# EAGLE design LVDS-DIP-01 (EAGLE 7.7.0)
LVDS DIP, C.H.I.P. Computer
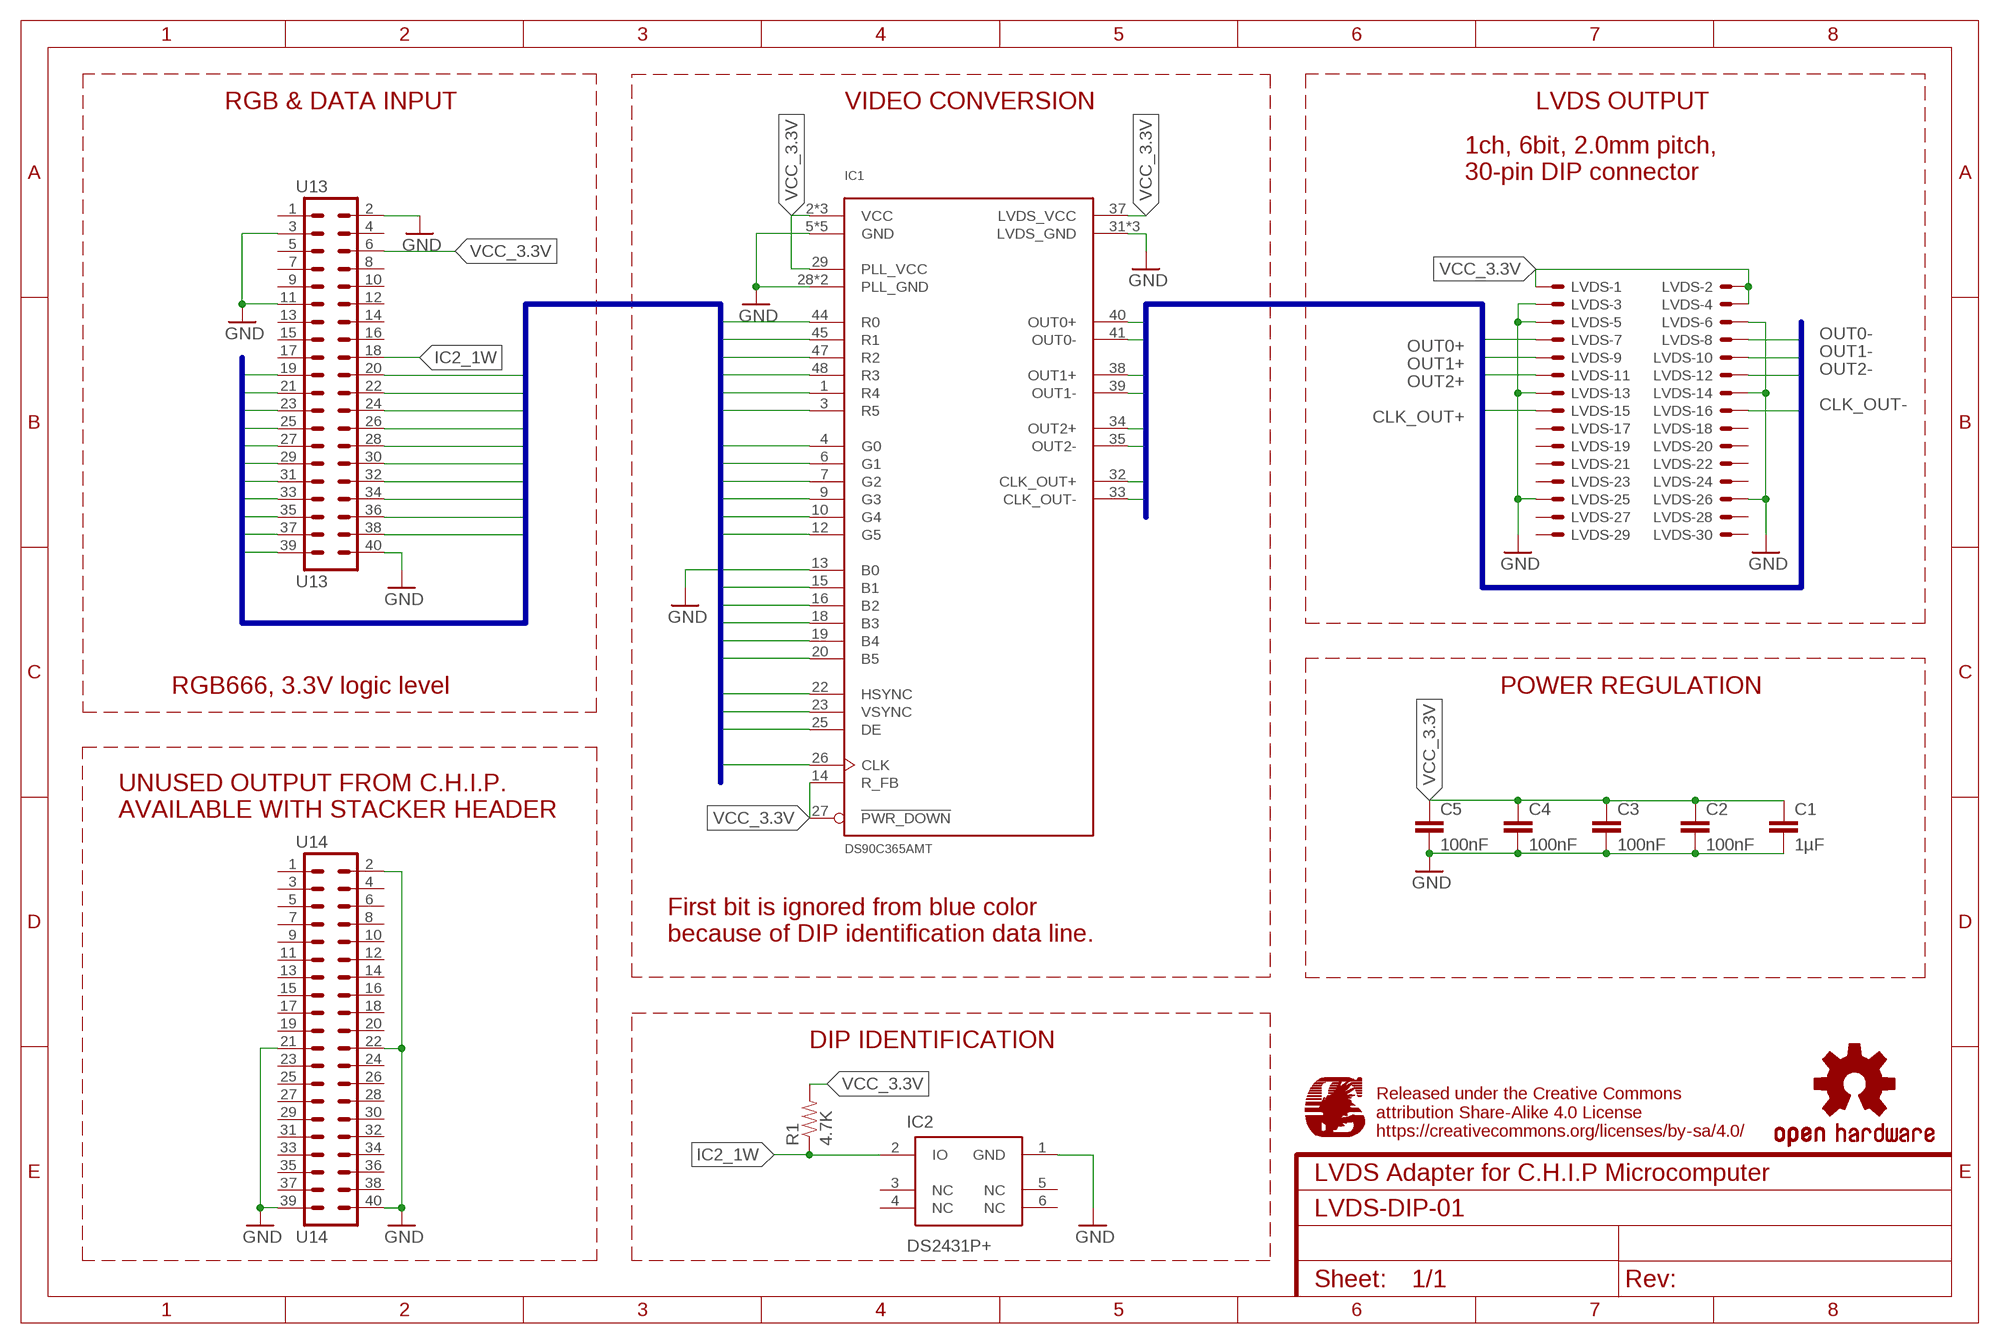
[diagram p0: schematic, sheet 1]
FRAME1 (FRAME-A4L): CNAME: LVDS Adapter for C.H.I.P Microcomputer; CREVISION: 1.00; DESIGNER: Juha P. Varjonen

## Parts
C1  1µF  CAP0603-CAP  [0603-CAP]
C2  100nF  CAP0603-CAP  [0603-CAP]
C3  100nF  CAP0603-CAP  [0603-CAP]
C4  100nF  CAP0603-CAP  [0603-CAP]
C5  100nF  CAP0603-CAP  [0603-CAP]
IC1  DS90C365AMT  [TSSOP48]
IC2  DS2431P+  [DS2431P+T&R]
LOGO1  OSHW-LOGOM  [OSHW-LOGO-M]
LVDS  332-30  [332-30]
R1  4.7K  4.7KOHM-1/10W-1%(0603)  [0603-RES]
U13  U13  M20X2  [2X20]
U14  U14  M20X2  [2X20]

## Nets
B1: IC1.15(B1) U13.19
B2: IC1.16(B2) U13.20
B3: IC1.18(B3) U13.21
B4: IC1.19(B4) U13.22
B5: IC1.20(B5) U13.23
CLK: IC1.26(CLK) U13.36
CLK_OUT+: IC1.32(CLK_OUT+) LVDS.15
CLK_OUT-: IC1.33(CLK_OUT-) LVDS.16
DE: IC1.25(DE) U13.39
G0: IC1.4(G0) U13.24
G1: IC1.6(G1) U13.25
G2: IC1.7(G2) U13.26
G3: IC1.9(G3) U13.27
G4: IC1.10(G4) U13.28
G5: IC1.12(G5) U13.29
GND: C1.2 C2.2 C3.2 C4.2 C5.2 IC1.5(GND) IC1.11(GND) IC1.13(B0) IC1.17(GND) IC1.24(GND) IC1.28(PLL_GND) IC1.30(PLL_GND) IC1.31(LVDS_GND) IC1.36(LVDS_GND) IC1.42(LVDS_GND) IC1.46(GND) IC2.1(GND) LVDS.3 LVDS.5 LVDS.6 LVDS.13 LVDS.14 LVDS.25 LVDS.26 U13.2 U13.3 U13.11 U13.40 U14.2 U14.21 U14.22 U14.39 U14.40
HSYNC: IC1.22(HSYNC) U13.37
IC2_1W: IC2.2(IO) R1.1 U13.18
OUT0+: IC1.40(OUT0+) LVDS.7
OUT0-: IC1.41(OUT0-) LVDS.8
OUT1+: IC1.38(OUT1+) LVDS.9
OUT1-: IC1.39(OUT1-) LVDS.10
OUT2+: IC1.34(OUT2+) LVDS.11
OUT2-: IC1.35(OUT2-) LVDS.12
R0: IC1.44(R0) U13.30
R1: IC1.45(R1) U13.31
R2: IC1.47(R2) U13.32
R3: IC1.48(R3) U13.33
R4: IC1.1(R4) U13.34
R5: IC1.3(R5) U13.35
VCC_3.3V: C1.1 C2.1 C3.1 C4.1 C5.1 IC1.2(VCC) IC1.8(VCC) IC1.14(R_FB) IC1.21(VCC) IC1.27(!PWR_DOWN!) IC1.29(PLL_VCC) IC1.37(LVDS_VCC) LVDS.1 LVDS.2 LVDS.4 R1.2 U13.6
VSYNC: IC1.23(VSYNC) U13.38
Unconnected: IC2.3(NC) IC2.4(NC) IC2.5(NC) IC2.6(NC) LVDS.17 LVDS.18 LVDS.19 LVDS.20 LVDS.21 LVDS.22 LVDS.23 LVDS.24 LVDS.27 LVDS.28 LVDS.29 LVDS.30 U13.1 U13.4 U13.5 U13.7 U13.8 U13.9 U13.10 U13.12 U13.13 U13.14 U13.15 U13.16 U13.17 U14.1 U14.3 U14.4 U14.5 U14.6 U14.7 U14.8 U14.9 U14.10 U14.11 U14.12 U14.13 U14.14 U14.15 U14.16 U14.17 U14.18 U14.19 U14.20 U14.23 U14.24 U14.25 U14.26 U14.27 U14.28 U14.29 U14.30 U14.31 U14.32 U14.33 U14.34 U14.35 U14.36 U14.37 U14.38

## Buses
R[0..5],G[0..5],B[1..5],HSYNC,VSYNC,DE,CLK
OUT0+,OUT0-,OUT1+,OUT1-,OUT2+,OUT2-,CLK_OUT+,CLK_OUT-

## Notes on the sheet
- RGB & DATA INPUT | VIDEO CONVERSION | LVDS OUTPUT
- 1ch, 6bit, 2.0mm pitch, 
  30-pin DIP connector
- RGB666, 3.3V logic level | POWER REGULATION
- UNUSED OUTPUT FROM C.H.I.P.
  AVAILABLE WITH STACKER HEADER
- First bit is ignored from blue color 
  because of DIP identification data line.
- DIP IDENTIFICATION
- Released under the Creative Commons
  attribution Share-Alike 4.0 License
  https://creativecommons.org/licenses/by-sa/4.0/

## Library data of the parts
C1-C5 = SparkFun-Capacitors:CAP: Capacitor Standard 0603 ceramic capacitor, and 0.1" leaded capacitor.
IC1 = DS90C365AMT:DS90C365AMT: 3.3V Programmable LVDS Transmitter, 18-bit, 1ch, RGB666
IC2 = ds2431:DS2431P+: 1024-bit, 1-Wire EEPROM
LOGO1 = SparkFun-Aesthetics:OSHW-LOGO: Open Source Hardware Logo This logo indicates the piece of hardware it is found on incorporates a OSHW license and/or adheres to the definition of open source hardware found here: http://freedomdefined.org/OSHW
LVDS = con-garry:332-30: 30 Pin - 2mm Dual Row Source: www.mpe-connector.de / garry_shortform_2012.pdf
R1 = SparkFun-Resistors:4.7KOHM-1/10W-1%(0603): RES-07857; PROD_ID: RES-07857
U13 U14 = SparkFun-Connectors:M20X2: 0.1" spaced headers

## Board
LVDS Display Adapter for C.H.I.P. Microcomputer
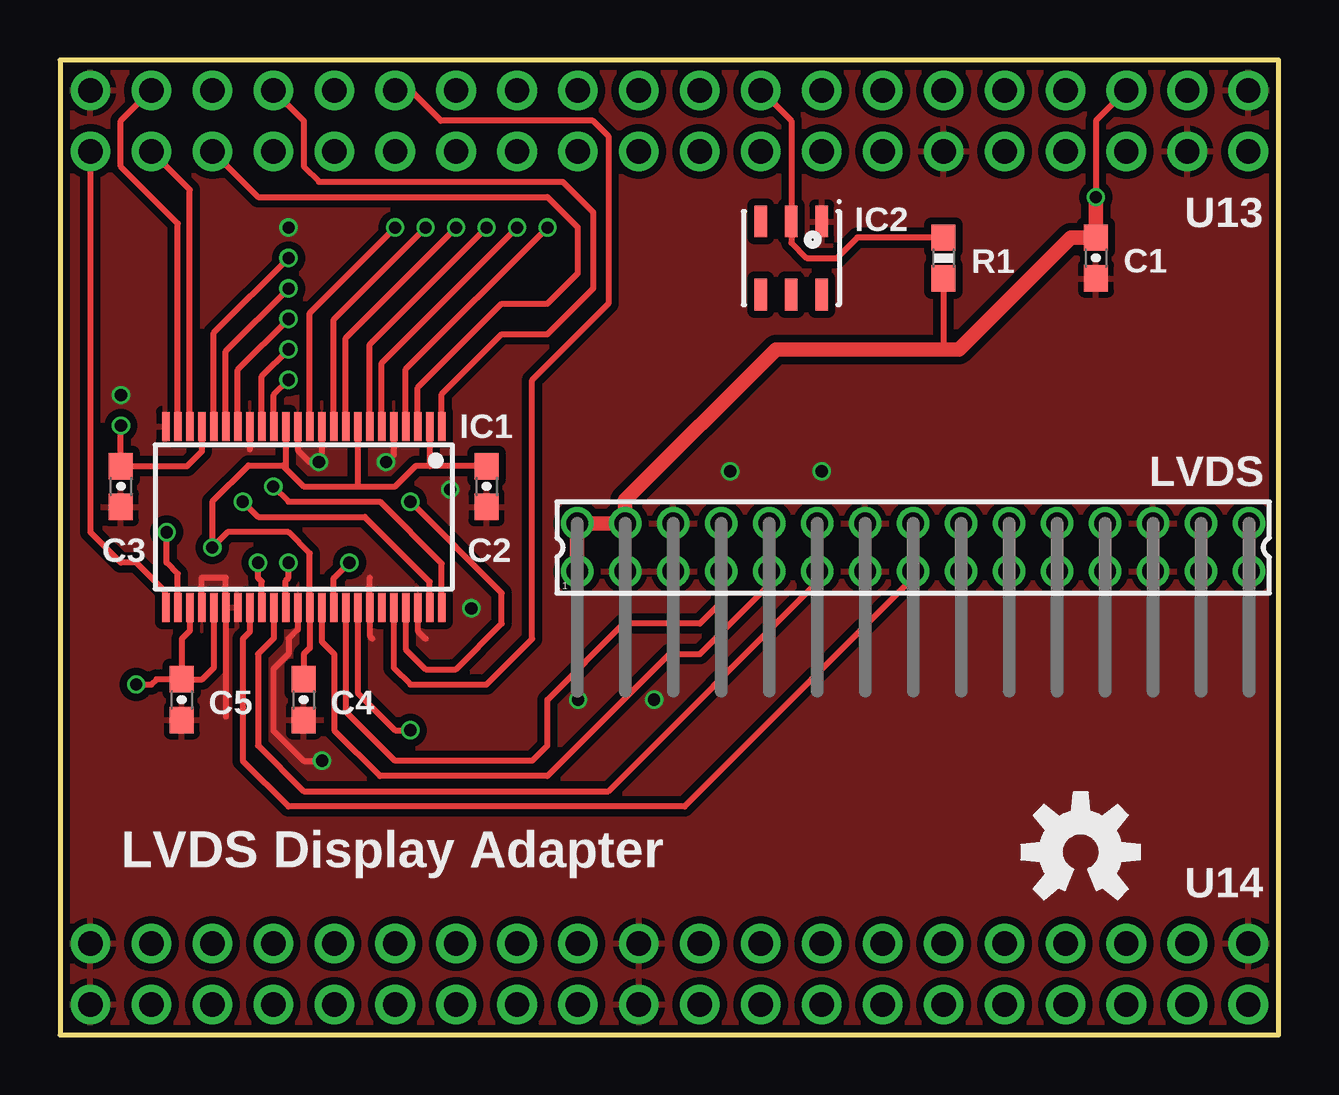
[diagram p1: board, top side]
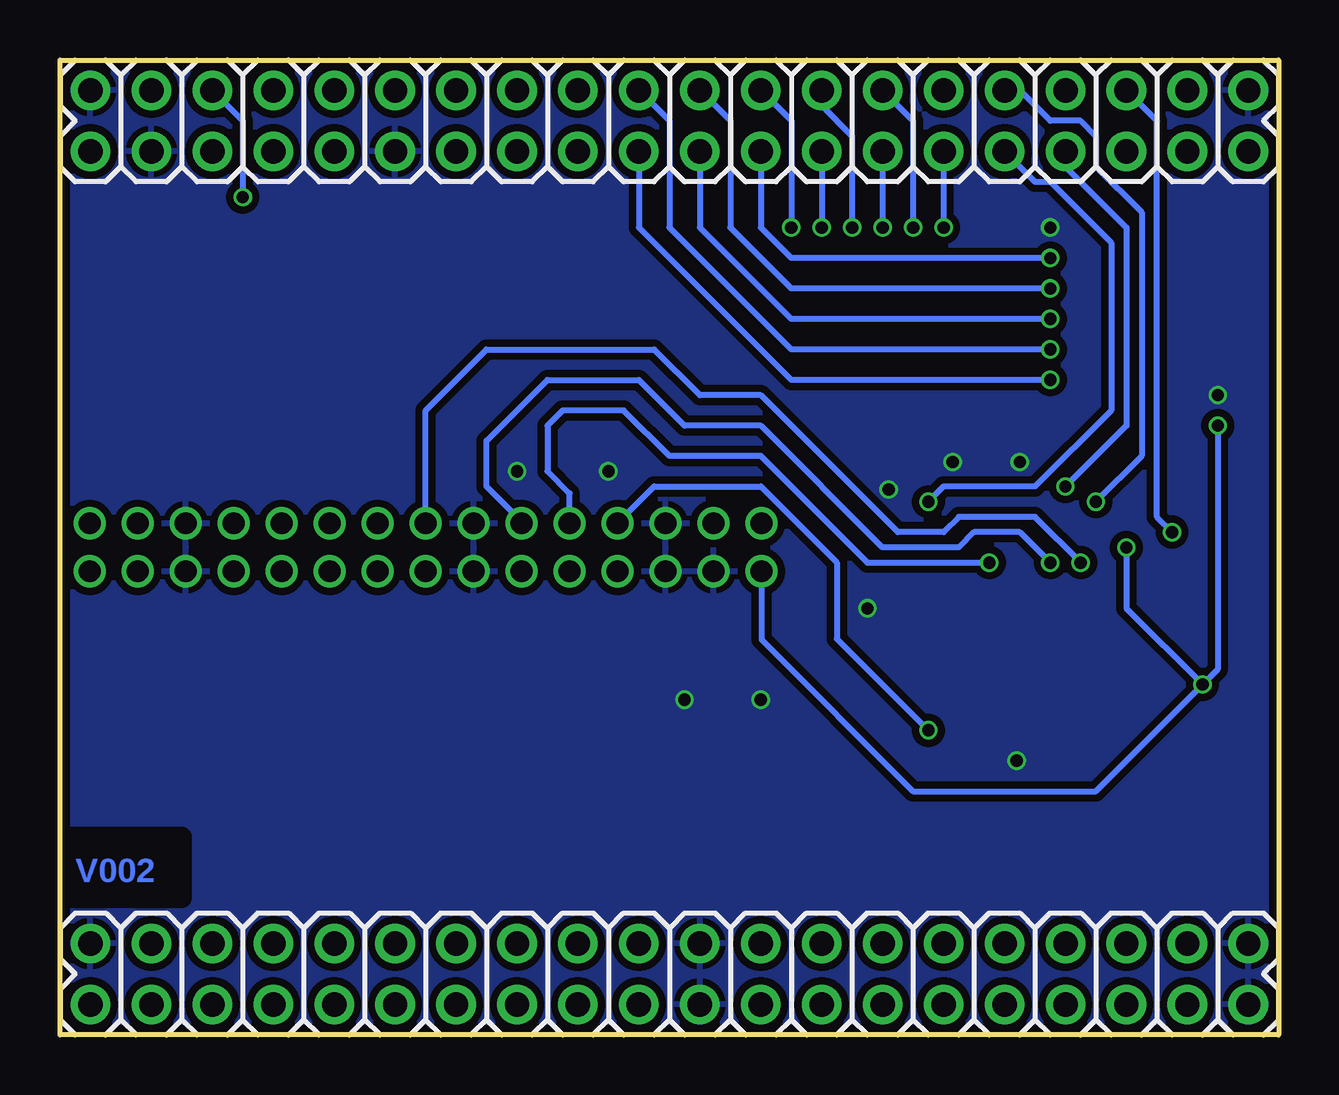
[diagram p2: board, bottom side, seen from below]

Size 50.8 x 40.64 mm. Coordinates in mm from the lower left corner, seen from the top.
Outline: 0,40.64 0,0 50.8,0 50.8,40.64 0,40.64
Copper layers (1*16): Top 0.035mm / dielectric 1.5mm / Bottom 0.035mm
Design rules "SparkFun-2-layer-STANDARD": minimum track width 4mil, minimum drill 6mil, track to track 4mil, track to pad 4mil, pad to pad 4mil, via to via 4mil, smd to smd 4mil, copper to edge 4mil, drill to drill 4mil, minimum pad ring 5mil, minimum via ring 5mil, stop-mask expansion 4mil, vias tented up to drill 25mil, thermal gap 10mil
bRestrict: 4 lines

### Footprints (pad centres in the part's own frame; a part is rotated, then mirrored left to right if it is on the bottom)
0603-CAP = smd 1.1 x 1: 1 -0.85,0; 2 0.85,0
TSSOP48 = smd 0.32 x 1.2: 1 -5.75,-3.775; 2 -5.25,-3.775; 3 -4.75,-3.775; 4 -4.25,-3.775; 5 -3.75,-3.775; 6 -3.25,-3.775; 7 -2.75,-3.775; 8 -2.25,-3.775; 9 -1.75,-3.775; 10 -1.25,-3.775; 11 -0.75,-3.775; 12 -0.25,-3.775; 13 0.25,-3.775; 14 0.75,-3.775; 15 1.25,-3.775; 16 1.75,-3.775; 17 2.25,-3.775; 18 2.75,-3.775; 19 3.25,-3.775; 20 3.75,-3.775; 21 4.25,-3.775; 22 4.75,-3.775; 23 5.25,-3.775; 24 5.75,-3.775; 25 5.75,3.775; 26 5.25,3.775; 27 4.75,3.775; 28 4.25,3.775; 29 3.75,3.775; 30 3.25,3.775; 31 2.75,3.775; 32 2.25,3.775; 33 1.75,3.775; 34 1.25,3.775; 35 0.75,3.775; 36 0.25,3.775; 37 -0.25,3.775; 38 -0.75,3.775; 39 -1.25,3.775; 40 -1.75,3.775; 41 -2.25,3.775; 42 -2.75,3.775; 43 -3.25,3.775; 44 -3.75,3.775; 45 -4.25,3.775; 46 -4.75,3.775; 47 -5.25,3.775; 48 -5.75,3.775
DS2431P+T&R = smd 1.33 x 0.53: 1 -1.525,1.27; 2 -1.525,0; 3 -1.525,-1.27; 4 1.525,-1.27; 5 1.525,0; 6 1.525,1.27
332-30 = drill 0.9 pad 1.27: 1 -14,-1; 2 -14,1; 3 -12,-1; 4 -12,1; 5 -10,-1; 6 -10,1; 7 -8,-1; 8 -8,1; 9 -6,-1; 10 -6,1; 11 -4,-1; 12 -4,1; 13 -2,-1; 14 -2,1; 15 0,-1; 16 0,1; 17 2,-1; 18 2,1; 19 4,-1; 20 4,1; 21 6,-1; 22 6,1; 23 8,-1; 24 8,1; 25 10,-1; 26 10,1; 27 12,-1; 28 12,1; 29 14,-1; 30 14,1
0603-RES = smd 1.1 x 1: 1 -0.85,0; 2 0.85,0
2X20 = drill 1.016 pad 1.651: 1 -24.13,-1.27; 2 -24.13,1.27; 3 -21.59,-1.27; 4 -21.59,1.27; 5 -19.05,-1.27; 6 -19.05,1.27; 7 -16.51,-1.27; 8 -16.51,1.27; 9 -13.97,-1.27; 10 -13.97,1.27; 11 -11.43,-1.27; 12 -11.43,1.27; 13 -8.89,-1.27; 14 -8.89,1.27; 15 -6.35,-1.27; 16 -6.35,1.27; 17 -3.81,-1.27; 18 -3.81,1.27; 19 -1.27,-1.27; 20 -1.27,1.27; 21 1.27,-1.27; 22 1.27,1.27; 23 3.81,-1.27; 24 3.81,1.27; 25 6.35,-1.27; 26 6.35,1.27; 27 8.89,-1.27; 28 8.89,1.27; 29 11.43,-1.27; 30 11.43,1.27; 31 13.97,-1.27; 32 13.97,1.27; 33 16.51,-1.27; 34 16.51,1.27; 35 19.05,-1.27; 36 19.05,1.27; 37 21.59,-1.27; 38 21.59,1.27; 39 24.13,-1.27; 40 24.13,1.27

### Placement (x,y rotation side)
C1  43.18,32.38 270 top
C2  17.78,22.86 270 top
C3  2.54,22.86 270 top
C4  10.16,13.97 270 top
C5  5.08,13.97 270 top
IC1  10.16,21.59 180 top
IC2  30.48,32.38 270 top
LOGO1  42.55,7.62 0 top
LVDS  35.56,20.32 0 top
R1  36.83,32.38 270 top
U13  25.4,38.1 0 bottom
U14  25.4,2.54 0 bottom

### Tracks (layer width: path | path; a pad name or v marks a point on that pad's centre or on a via)
B1  (via drill 0.51)
  Top 0.254: IC1.15 8.91,26.69 v9.53,27.3
  Bottom 0.254: U13.19 26.67,33.66 20.32,27.3 v9.53,27.3
B2  (via drill 0.51)
  Top 0.254: IC1.16 8.41,27.46 v9.53,28.57
  Bottom 0.254: U13.20 25.4,38.1 25.4,33.66 20.32,28.57 v9.53,28.57
B3  (via drill 0.51)
  Top 0.254: IC1.18 7.41,27.73 v9.53,29.84
  Bottom 0.254: U13.21 24.13,33.66 20.32,29.84 v9.53,29.84
B4  (via drill 0.51)
  Top 0.254: IC1.19 6.91,28.5 v9.53,31.11
  Bottom 0.254: U13.22 22.86,38.1 22.86,33.66 20.32,31.11 v9.53,31.11
B5  (via drill 0.51)
  Top 0.254: IC1.20 6.41,29.27 v9.53,32.38
  Bottom 0.254: U13.23 21.59,33.66 20.32,32.38 v9.53,32.38
CLK  (via drill 0.51)
  Top 0.254: IC1.26 4.91,19.22 4.45,19.68 v4.45,20.95
  Bottom 0.254: v4.45,20.95 5.08,21.59 5.08,38.1 U13.36
CLK_OUT+
  Top 0.254: LVDS.15 35.56,19.05 26.04,9.53 9.53,9.53 7.62,11.43 7.62,16.51 7.91,16.8 IC1.32
CLK_OUT-  (via drill 0.51)
  Top 0.254: IC1.33 8.41,18.89 8.26,19.05 v8.26,19.68
  Bottom 0.254: v8.26,19.68 10.16,21.59 13.34,21.59 13.97,20.95 15.88,20.95 21.59,26.67 24.13,26.67 26.04,28.57 33.02,28.57 35.56,26.04 LVDS.16
DE
  Top 0.254: U13.39 1.27,20.95 2.54,19.68 3.17,19.68 4.38,18.48 4.38,17.78 IC1.25
G0  (via drill 0.51)
  Top 0.254: IC1.4 14.41,27.75 v20.32,33.66
  Bottom 0.254: U13.24 20.32,38.1 v20.32,33.66
G1  (via drill 0.51)
  Top 0.254: IC1.6 13.41,28.02 v19.05,33.66
  Bottom 0.254: U13.25 v19.05,33.66
G2  (via drill 0.51)
  Top 0.254: IC1.7 12.91,28.79 v17.78,33.66
  Bottom 0.254: U13.26 19.05,38.73 17.78,37.47 v17.78,33.66
G3  (via drill 0.51)
  Top 0.254: IC1.9 11.91,29.05 v16.51,33.66
  Bottom 0.254: U13.27 v16.51,33.66
G4  (via drill 0.51)
  Top 0.254: v15.24,33.66 11.41,29.82 IC1.10
  Bottom 0.254: U13.28 15.24,38.1 v15.24,33.66
G5  (via drill 0.51)
  Top 0.254: v13.97,33.66 10.41,30.09 IC1.12
  Bottom 0.254: U13.29 v13.97,33.66
GND  (via drill 0.51)
  Top 0.254: IC1.17 7.91,24.42 | IC1.46 14.91,16.84 15.24,16.51 | 6.91,13.26 IC1.30 6.91,19.05 5.91,19.05 IC1.28 | IC1.11 10.91,24.25 | IC1.5 13.91,24.19 | IC1.13 9.91,24.38 10.41,23.88 v10.79,23.88 | 13.03,16.51 12.91,16.63 IC1.42 12.91,19.05 | IC1.36 9.91,16.89 9.53,16.51 9.53,15.88 8.89,15.24 8.89,12.7 10.16,11.43 v10.92,11.43
  other vias: 2.54,26.67 17.14,17.78 16.26,22.73 13.59,23.88 27.94,23.5 31.75,23.5 21.59,13.97 24.77,13.97 9.53,33.66
  pour Bottom (isolate 0.305): 0,40.64 50.8,40.64 50.8,0 0,0
  pour Top (isolate 0.305): 0,40.64 50.8,40.64 50.8,0 0,0
HSYNC
  Top 0.254: IC1.22 5.41,35.23 U13.37
IC2_1W
  Top 0.254: U13.18 30.48,38.1 IC2.2 30.48,33.02 31.11,32.38 32.38,32.38 33.23,33.23 R1.1
OUT0+
  Top 0.254: IC1.40 11.91,13.49 13.97,11.43 19.68,11.43 20.32,12.06 20.32,13.97 23.5,17.14 26.67,17.14 27.56,18.04 LVDS.7
OUT0-  (via drill 0.51)
  Top 0.254: IC1.41 12.41,14.26 13.97,12.7 v14.61,12.7
  Bottom 0.254: LVDS.8 27.56,21.34 26.04,22.86 21.59,22.86 18.41,19.68 18.41,16.51 v14.61,12.7
OUT1+
  Top 0.254: LVDS.9 29.56,18.77 26.67,15.88 25.4,15.88 20.32,10.79 13.34,10.79 11.43,12.7 11.43,15.88 10.91,16.39 IC1.38
OUT1-  (via drill 0.51)
  Top 0.254: IC1.39 11.41,19.05 11.43,19.05 v12.06,19.68
  Bottom 0.254: v12.06,19.68 17.14,19.68 21.59,24.13 25.4,24.13 27.3,26.04 29.84,26.04 30.48,25.4 30.48,23.5 29.56,22.57 LVDS.10 29.56,21.3
OUT2+
  Top 0.254: LVDS.11 31.56,18.86 22.86,10.16 10.16,10.16 8.26,12.06 8.26,15.88 8.91,16.53 IC1.34
OUT2-  (via drill 0.51)
  Top 0.254: IC1.35 9.41,18.93 9.53,19.05 v9.53,19.68
  Bottom 0.254: v9.53,19.68 10.79,20.95 12.7,20.95 13.34,20.32 16.51,20.32 21.59,25.4 24.77,25.4 26.67,27.3 30.48,27.3 33.02,24.77 33.02,22.86 31.56,21.4 LVDS.12
R0
  Top 0.254: IC1.44 13.91,15.3 14.61,14.61 17.78,14.61 19.68,16.51 19.68,27.3 22.86,30.48 22.86,37.47 22.23,38.1 15.88,38.1 14.61,39.37 U13.30
R1  (via drill 0.51)
  Top 0.254: IC1.45 14.41,16.07 15.24,15.24 16.51,15.24 18.41,17.14 18.41,18.41 v14.61,22.23
  Bottom 0.254: U13.31 10.16,35.56 9.53,35.56 6.99,33.02 6.99,26.04 10.16,22.86 13.97,22.86 v14.61,22.23
R2  (via drill 0.51)
  Top 0.254: IC1.47 15.41,18.88 12.7,21.59 8.26,21.59 v7.62,22.23
  Bottom 0.254: U13.32 10.79,39.37 9.53,38.1 8.26,38.1 7.62,37.47 7.62,36.2 5.71,34.29 5.71,24.13 v7.62,22.23
R3  (via drill 0.51)
  Top 0.254: v8.89,22.86 9.53,22.23 13.34,22.23 15.91,19.65 IC1.48
  Bottom 0.254: U13.33 8.89,36.2 6.35,33.66 6.35,25.4 v8.89,22.86
R4
  Top 0.254: U13.34 10.16,38.1 10.16,36.2 10.79,35.56 20.95,35.56 22.23,34.29 22.23,31.11 20.32,29.21 18.41,29.21 15.91,26.7 IC1.1
R5
  Top 0.254: U13.35 8.26,34.92 20.32,34.92 21.59,33.66 21.59,31.75 20.32,30.48 18.41,30.48 14.91,26.98 IC1.3
VCC_3.3V  (via drill 0.51)
  Top 0.254: U13.6 43.18,38.1 v43.18,34.92 | IC1.14 9.41,23.61 | IC1.8 12.41,22.86 | IC1.21 5.91,24.32 5.29,23.71 C3.1 v2.54,25.4 | 9.41,23.61 9.29,23.73 7.86,23.73 6.35,22.23 v6.35,20.32 6.99,20.95 9.53,20.95 10.41,20.07 IC1.37 10.41,16.12 10.16,15.88 C4.1 | 9.41,23.61 10.16,22.86 12.41,22.86 | 12.41,22.86 13.97,22.86 14.82,23.71 15.41,23.71 | IC1.27 5.41,16.84 5.08,16.51 C5.1 | R1.2 36.83,28.57 | C2.1 15.41,23.71 | IC1.2 15.41,23.71 | C5.1 5.11,14.85 | v3.17,14.61 3.81,14.61 4.03,14.82 C5.1 | IC1.29 6.41,15.3 5.93,14.82 C5.1
  Top 0.61: LVDS.1 LVDS.2 LVDS.4 23.56,22.29 29.84,28.57 36.83,28.57 37.47,28.57 42.12,33.23 C1.1 v43.18,34.92
  Bottom 0.254: v3.17,14.61 7.62,10.16 15.24,10.16 21.56,16.48 LVDS.1 | U13.6 43.18,38.1 v43.18,34.92 | v2.54,25.4 2.54,15.24 v3.17,14.61 | v6.35,20.32 6.35,17.78 v3.17,14.61
VSYNC
  Top 0.254: IC1.23 4.91,33.83 2.54,36.2 2.54,38.1 U13.38

### Text on the board
Bottom: V002
tNames: LVDS Display Adapter
Notes: Released under the Creative Commons / attribution Share-Alike 4.0 License / https://creativecommons.org/licenses/by-sa/4.0/ | Design by: Juha P. Varjonen